# Altium schematic sheet S03.SchDoc: IEEE-1394/Ethernet FPGA Controller
size 381 x 254 mm; Revision: 2.1; SheetNumber: 3; SheetTotal: 6
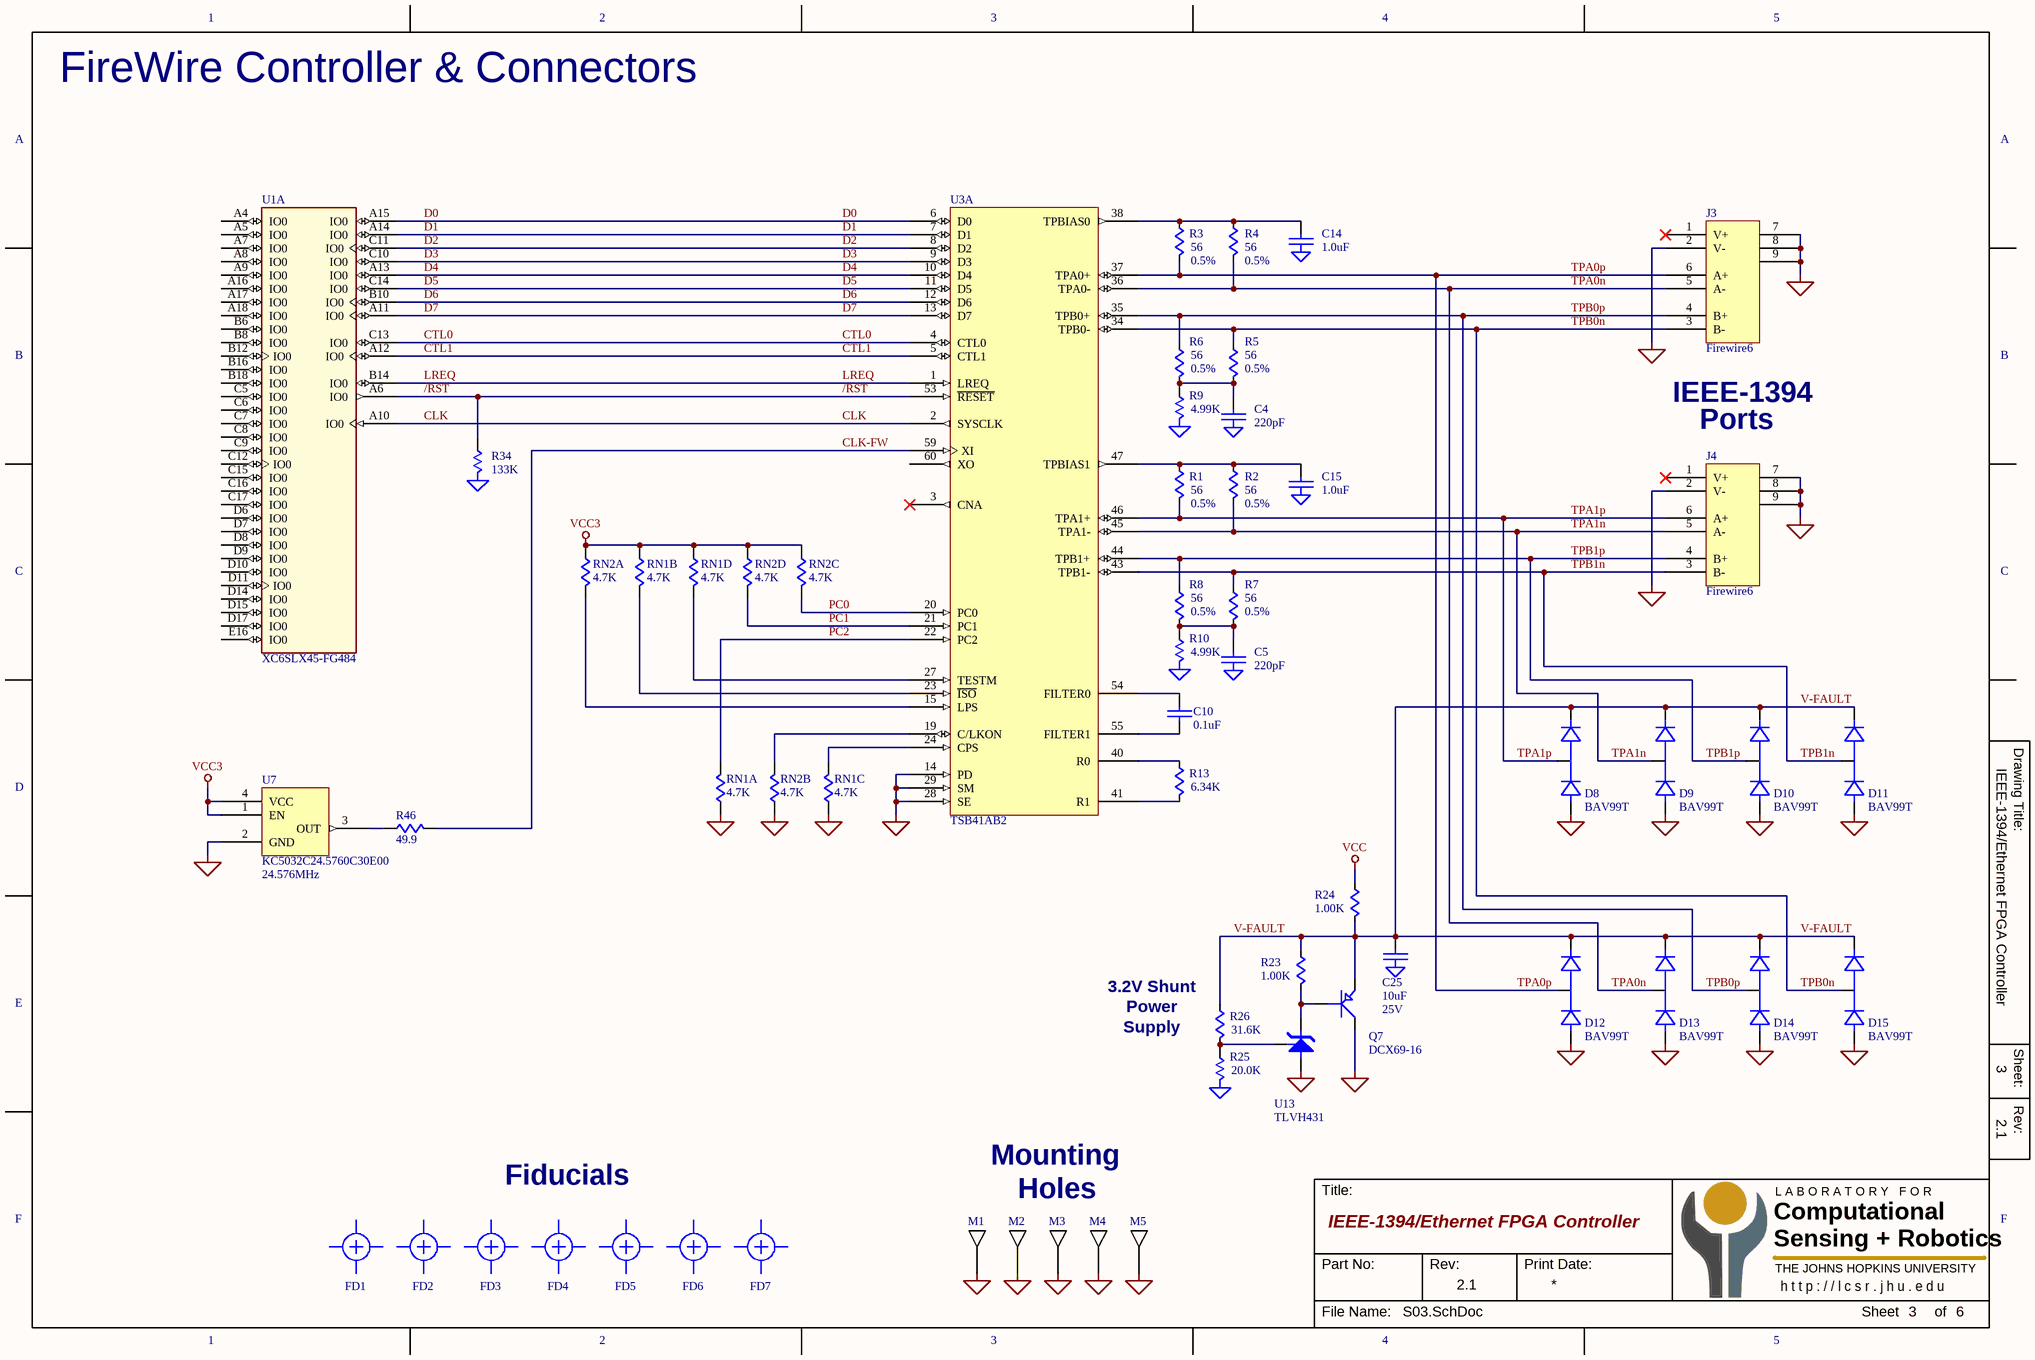
[diagram p0: S03.SchDoc]

## Parts
C4  220pF  [C0603]
C5  220pF  [C0603]
C10  0.1uF  [C0603]
C14  1.0uF  [C0603]
C15  1.0uF  [C0603]
C25  10uF  [C0805]
D8  BAV99T  [SOT-523]
D9  BAV99T  [SOT-523]
D10  BAV99T  [SOT-523]
D11  BAV99T  [SOT-523]
D12  BAV99T  [SOT-523]
D13  BAV99T  [SOT-523]
D14  BAV99T  [SOT-523]
D15  BAV99T  [SOT-523]
FD1  FD  [FD]  (value not drawn)
FD2  FD  [FD]  (value not drawn)
FD3  FD  [FD]  (value not drawn)
FD4  FD  [FD]  (value not drawn)
FD5  FD  [FD]  (value not drawn)
FD6  FD  [FD]  (value not drawn)
FD7  FD  [FD]  (value not drawn)
J3  Firewire6  [Firewire6-RA]
J4  Firewire6  [Firewire6-RA]
M1  MHOLE  [MHOLE4]  (value not drawn)  (no BOM)
M2  MHOLE  [MHOLE4]  (value not drawn)  (no BOM)
M3  MHOLE  [MHOLE4]  (value not drawn)  (no BOM)
M4  MHOLE  [MHOLE4]  (value not drawn)  (no BOM)
M5  MHOLE  [MHOLE4]  (value not drawn)  (no BOM)
Q7  DCX69-16  [SOT-89]
R1  56  Toll: 0.5%  [R0603]
R2  56  Toll: 0.5%  [R0603]
R3  56  Toll: 0.5%  [R0603]
R4  56  Toll: 0.5%  [R0603]
R5  56  Toll: 0.5%  [R0603]
R6  56  Toll: 0.5%  [R0603]
R7  56  Toll: 0.5%  [R0603]
R8  56  Toll: 0.5%  [R0603]
R9  4.99K  [R0603]
R10  4.99K  [R0603]
R13  6.34K  [R0603]
R23  1.00K  [R0603]
R24  1.00K  [R0603]
R25  20.0K  [R0603]
R26  31.6K  [R0603]
R34  133K  [R0603]
R46  49.9  [R0402]
RN1  4.7K  [RN-742C083]  (parts A,B,C,D of 4)
RN2  4.7K  [RN-742C083]  (parts A,B,C,D of 4)
U1  XC6SLX45-FG484  [FG-484]  (part A of 8)
U3  TSB41AB2  [PQFP-65]  (part A of 2)
U7  KC5032C24.5760C30E00  Freq: 24.576MHz  [OSC-3x5MM]
U13  TLVH431  [SC70-6]

## Nets
GND: C4.2(GND) C5.2(GND) C14.2(GND) C15.2(GND) C25.2(GND) D8.1(A) D9.1(A) D10.1(A) D11.1(A) D12.1(A) D13.1(A) D14.1(A) D15.1(A) J3.2(V-) J3.7(CHASIS) J3.8(CHASIS) J3.9(CHASIS) J4.2(V-) J4.7(CHASIS) J4.8(CHASIS) J4.9(CHASIS) M1.1 M2.1 M3.1 M4.1 M5.1 Q7.3(C) R9.2(GND) R10.2(GND) R25.2(GND) R34.2(GND) RN1.1 RN1.3 RN2.2 U3.14(PD) U3.28(SE) U3.29(SM) U7.2(GND) U13.6(A)
VCC: R24.1
VCC3: RN1.2 RN1.4 RN2.1 RN2.3 RN2.4 U7.1(EN) U7.4(VCC)
/RST: R34.1 U1.A6(IO0) U3.53(~{RESET})
CLK: U1.A10(IO0) U3.2(SYSCLK)
CLK-FW: R46.2 U3.59(XI)
CTL0: U1.C13(IO0) U3.4(CTL0)
CTL1: U1.A12(IO0) U3.5(CTL1)
D0: U1.A15(IO0) U3.6(D0)
D1: U1.A14(IO0) U3.7(D1)
D2: U1.C11(IO0) U3.8(D2)
D3: U1.C10(IO0) U3.9(D3)
D4: U1.A13(IO0) U3.10(D4)
D5: U1.C14(IO0) U3.11(D5)
D6: U1.B10(IO0) U3.12(D6)
D7: U1.A11(IO0) U3.13(D7)
LREQ: U1.B14(IO0) U3.1(LREQ)
PC0: RN2.6 U3.20(PC0)
PC1: RN2.5 U3.21(PC1)
PC2: RN1.8 U3.22(PC2)
TPA0n: D13.3(COM) J3.5(A-) R4.2 U3.36(TPA0-)
TPA0p: D12.3(COM) J3.6(A+) R3.2 U3.37(TPA0+)
TPA1n: D9.3(COM) J4.5(A-) R2.2 U3.45(TPA1-)
TPA1p: D8.3(COM) J4.6(A+) R1.2 U3.46(TPA1+)
TPB0n: D15.3(COM) J3.3(B-) R5.1 U3.34(TPB0-)
TPB0p: D14.3(COM) J3.4(B+) R6.1 U3.35(TPB0+)
TPB1n: D11.3(COM) J4.3(B-) R7.1 U3.43(TPB1-)
TPB1p: D10.3(COM) J4.4(B+) R8.1 U3.44(TPB1+)
V-FAULT: C25.1 D8.2(C) D9.2(C) D10.2(C) D11.2(C) D12.2(C) D13.2(C) D14.2(C) D15.2(C) Q7.2(E) R23.1 R24.2 R26.1
NetC4_1: C4.1 R5.2 R6.2 R9.1
NetC5_1: C5.1 R7.2 R8.2 R10.1
NetC10_1: C10.1 U3.54(FILTER0)
NetC10_2: C10.2 U3.55(FILTER1)
NetC14_1: C14.1 R3.1 R4.1 U3.38(TPBIAS0)
NetC15_1: C15.1 R1.1 R2.1 U3.47(TPBIAS1)
NetQ7_1: Q7.1(B) R23.2 U13.1(C)
NetR13_1: R13.1 U3.40(R0)
NetR13_2: R13.2 U3.41(R1)
NetR25_1: R25.1 R26.2 U13.3(ADJ)
NetR46_1: R46.1 U7.3(OUT)
NetRN1_5: RN1.5 U3.27(TESTM)
NetRN1_6: RN1.6 U3.24(CPS)
NetRN1_7: RN1.7 U3.23(~{ISO})
NetRN2_7: RN2.7 U3.19(C/LKON)
NetRN2_8: RN2.8 U3.15(LPS)

Not connected (* = marked no-connect by the designer): J3 1(V+)*; J4 1(V+)*; U1 A4(IO0) A5(IO0) A7(IO0) A8(IO0) A9(IO0) A16(IO0) A17(IO0) A18(IO0) B6(IO0) B8(IO0) B12(IO0) B16(IO0) B18(IO0) C5(IO0) C6(IO0) C7(IO0) C8(IO0) C9(IO0) C12(IO0) C15(IO0) C16(IO0) C17(IO0) D6(IO0) D7(IO0) D8(IO0) D9(IO0) D10(IO0) D11(IO0) D14(IO0) D15(IO0) D17(IO0) E16(IO0); U3 3(CNA)* 60(XO)

## Notes on the sheet
- FireWire Controller & Connectors
- IEEE-1394
- (near J4) Ports
- (near R26) 3.2V Shunt
- Power
- Supply
- Mounting
- Fiducials
- Holes
- 1
- 2
- 3
- 4
- 5
- A
- B
- C
- Drawing Title:
- D
- E
- Sheet:
- Rev:
- F
- Title:
- Computational
- Sensing + Robotics
- L A B O R A T O R Y   F O R
- Part No:
- Print Date:
- THE JOHNS HOPKINS UNIVERSITY
- h t t p : / / l c s r . j h u . e d u
- File Name:
- Sheet
- of
- (in symbol CAP-GND) 25V

## Library data of the parts
C4 C5 C14 C15 C25 = CAP-GND
C10 = CAP
D8-D15 = DIODE-2/SER
M1-M5 = MHOLE: Mounting Hole
Q7 = PNP-SM
R1-R8 R13 R23 R24 R26 = R-MINI
R9 R10 R25 R34 = R-GND
R46 = R
RN1 RN2 = RN-DISC-SM-4X
U3 = TSB41AB2: IEEE 1394a-2000 Two-port Transceiver/Arbiter
U7 = OSCILATOR
U13 = TLVH431-SC70